# EAGLE design usb-lcd-2line-ta (EAGLE 5.11)
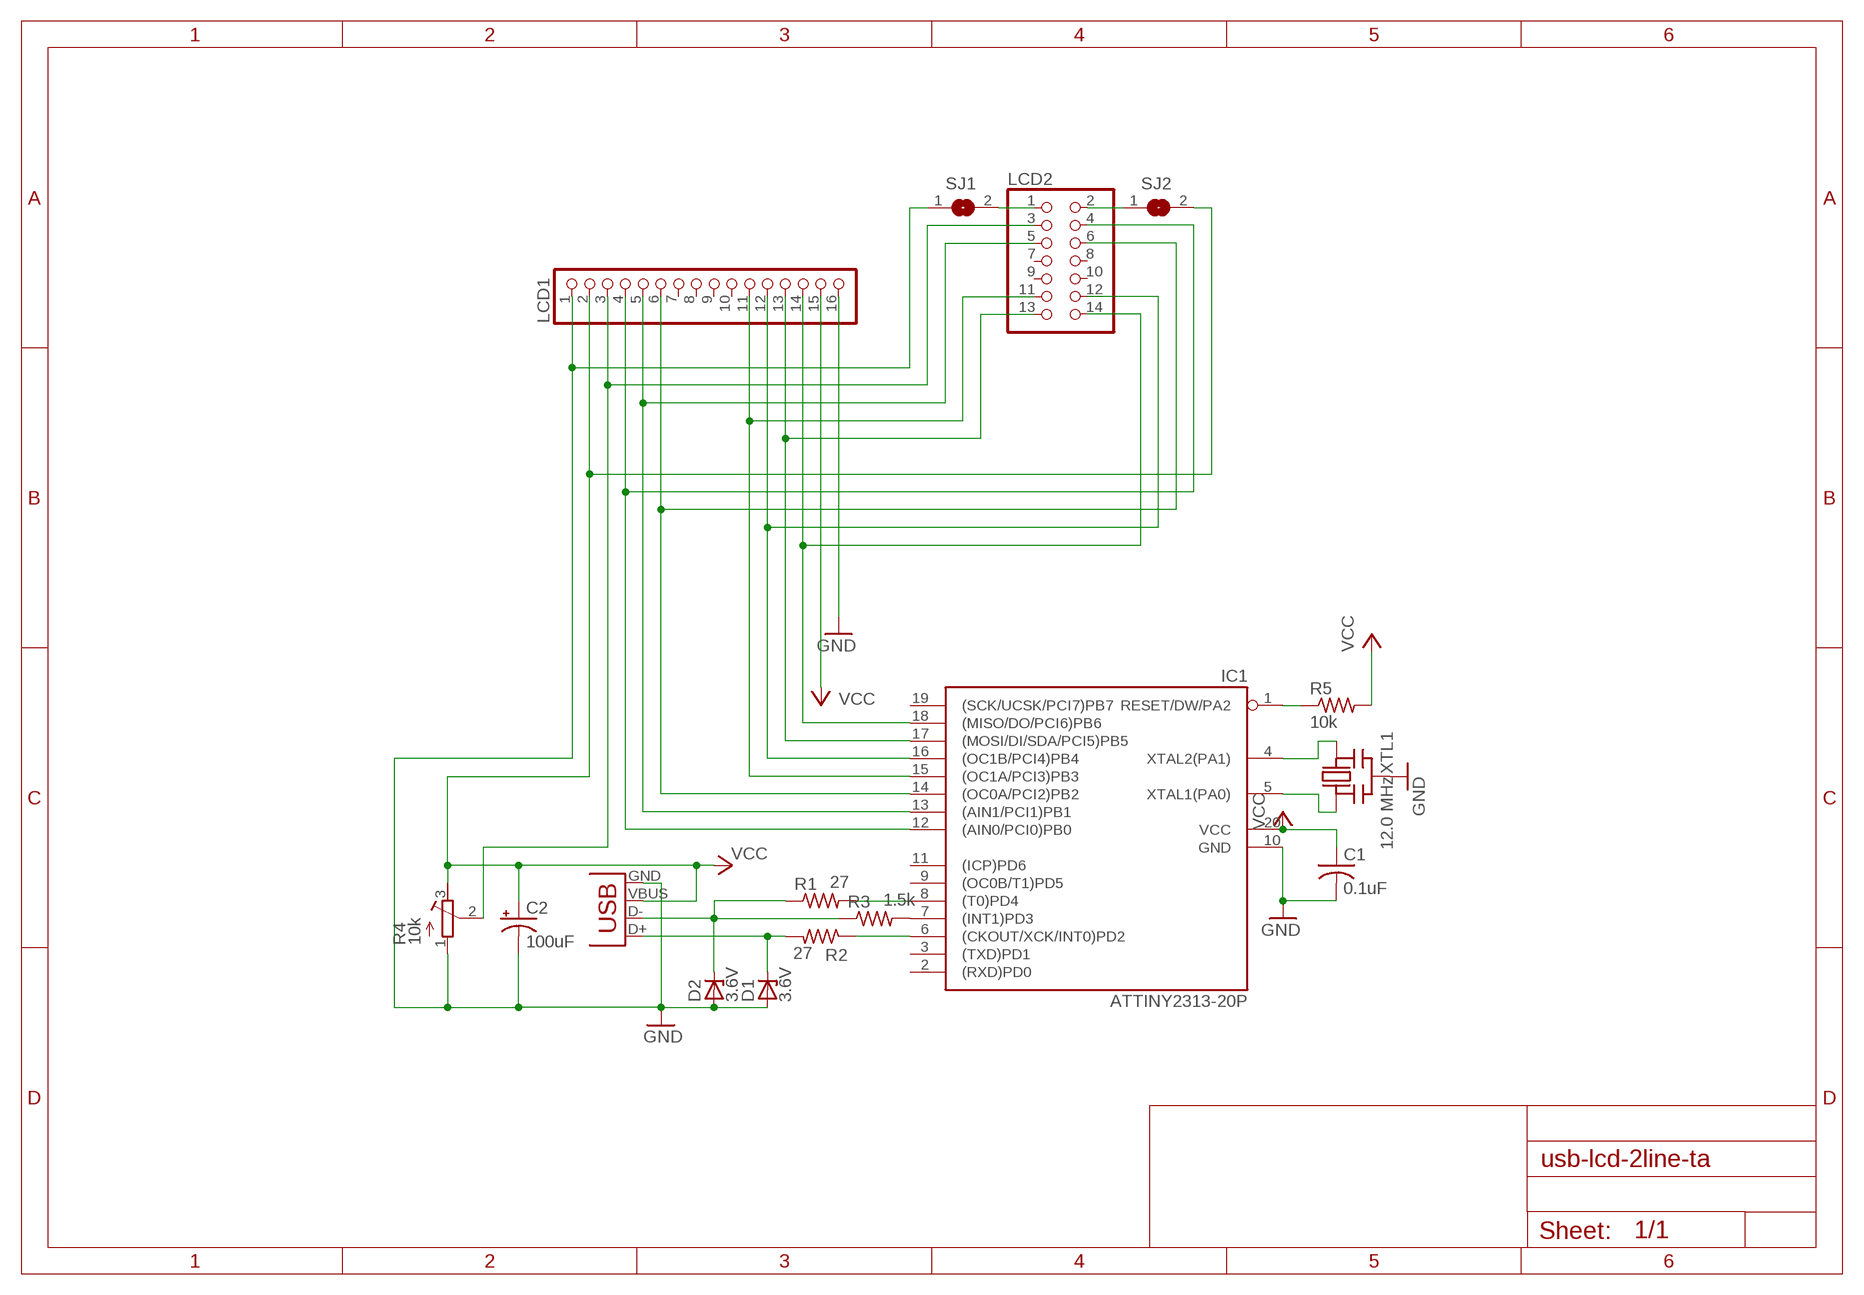
[diagram p0: schematic, sheet 1]

## Parts
C1  0.1uF  C-US025-025X050  [C025-025X050]
C2  100uF  CPOL-USE2-5  [E2-5]
D1  3.6V  ZENER-DIODEDO35Z10  [DO35Z10]
D2  3.6V  ZENER-DIODEDO35Z10  [DO35Z10]
IC1  ATTINY2313-20P  [DIL20]
LCD1  PINHD-1X16  [1X16]
LCD2  PINHD-2X7  [2X07]
R1  27  R-US_0207/10  [0207/10]
R2  27  R-US_0207/10  [0207/10]
R3  1.5k  R-US_0207/10  [0207/10]
R4  10k  R-TRIMM3296W  [RTRIM3296W]
R5  10k  R-US_0207/10  [0207/10]
SJ1  SJ  [SJ]
SJ2  SJ  [SJ]
X1  USBPTH  [USB-B-PTH]
XTL1  12.0 MHz  CERMOSCILL  [CERM_OSC]

## Nets
GND: C1.2 C2.- D1.A D2.A IC1.10(GND) LCD1.1 LCD1.16 R4.1(E) SJ1.1 X1.GND XTL1.P$2(GND)
N$1: D2.C R1.1 R3.1 X1.D-
N$2: IC1.5(XTAL1(PA0)) XTL1.P$1(IN)
N$3: IC1.8((T0)PD4) R1.2
N$4: IC1.4(XTAL2(PA1)) XTL1.P$3(OUT)
N$5: IC1.7((INT1)PD3) R3.2
N$6: IC1.6((CKOUT/XCK/INT0)PD2) R2.1
N$7: IC1.18((MISO/DO/PCI6)PB6) LCD1.14 LCD2.14
N$8: IC1.17((MOSI/DI/SDA/PCI5)PB5) LCD1.13 LCD2.13
N$9: IC1.1(RESET/DW/PA2) R5.1
N$10: D1.C R2.2 X1.D+
N$11: LCD1.3 LCD2.3 R4.2(S)
N$12: IC1.12((AIN0/PCI0)PB0) LCD1.4 LCD2.4
N$13: IC1.15((OC1A/PCI3)PB3) LCD1.11 LCD2.11
N$14: LCD2.1 SJ1.2
N$15: IC1.14((OC0A/PCI2)PB2) LCD1.6 LCD2.6
N$16: IC1.16((OC1B/PCI4)PB4) LCD1.12 LCD2.12
N$17: IC1.13((AIN1/PCI1)PB1) LCD1.5 LCD2.5
N$18: LCD2.2 SJ2.1
VCC: C1.1 C2.+ IC1.20(VCC) LCD1.2 LCD1.15 R4.3(A) R5.2 SJ2.2 X1.VBUS
Unconnected: IC1.2((RXD)PD0) IC1.3((TXD)PD1) IC1.9((OC0B/T1)PD5) IC1.11((ICP)PD6) IC1.19((SCK/UCSK/PCI7)PB7) LCD1.7 LCD1.8 LCD1.9 LCD1.10 LCD2.7 LCD2.8 LCD2.9 LCD2.10

## Library data of the parts
C1 = rcl-ez:C-US: CAPACITOR, American symbol
C2 = rcl-ez:CPOL-US: POLARIZED CAPACITOR, American symbol
D1 D2 = diode:ZENER-DIODE: Z-Diode
IC1 = avr:ATTINY2313: MICROCONTROLLER 2 Kbytes FLASH 128 bytes SRAM 128 bytes EEPROM USART USI
LCD1 = pinhead:PINHD-1X16: PIN HEADER
LCD2 = pinhead:PINHD-2X7: PIN HEADER
R1-R3 R5 = rcl-ez:R-US_: RESISTOR, American symbol
R4 = resistor:R-TRIMM: Trimm resistor
SJ1 SJ2 = jumper:SJ: SMD solder JUMPER
X1 = SparkFun:USB: USB Connectors USB-B-PTH is fully proven SKU : PRT-00139 USB-miniB is fully proven SKU : PRT-00587 USB-A-PCB is untested. USB-A-H is throughly reviewed, but untested. Spark Fun Electronics SKU : PRT-00437 USB-B-SMT is throughly reviewed, but untested. Needs silkscreen touching up. USB-A-S has not been used/tested USB-MB-H has not been used/tested
XTL1 = minimidi:CERMOSCILL

## Board
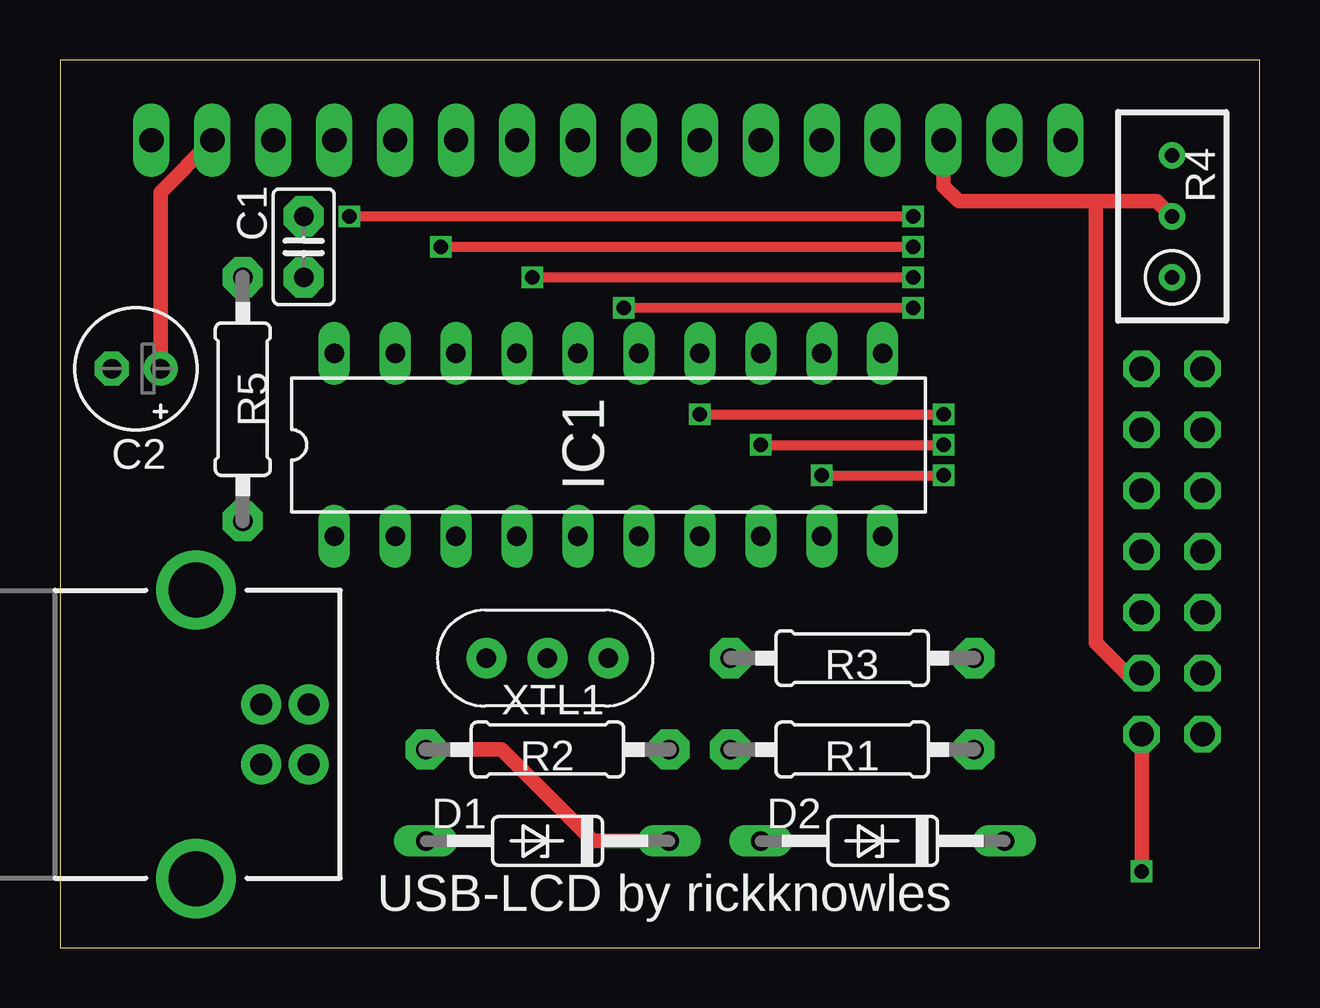
[diagram p1: board, top side]
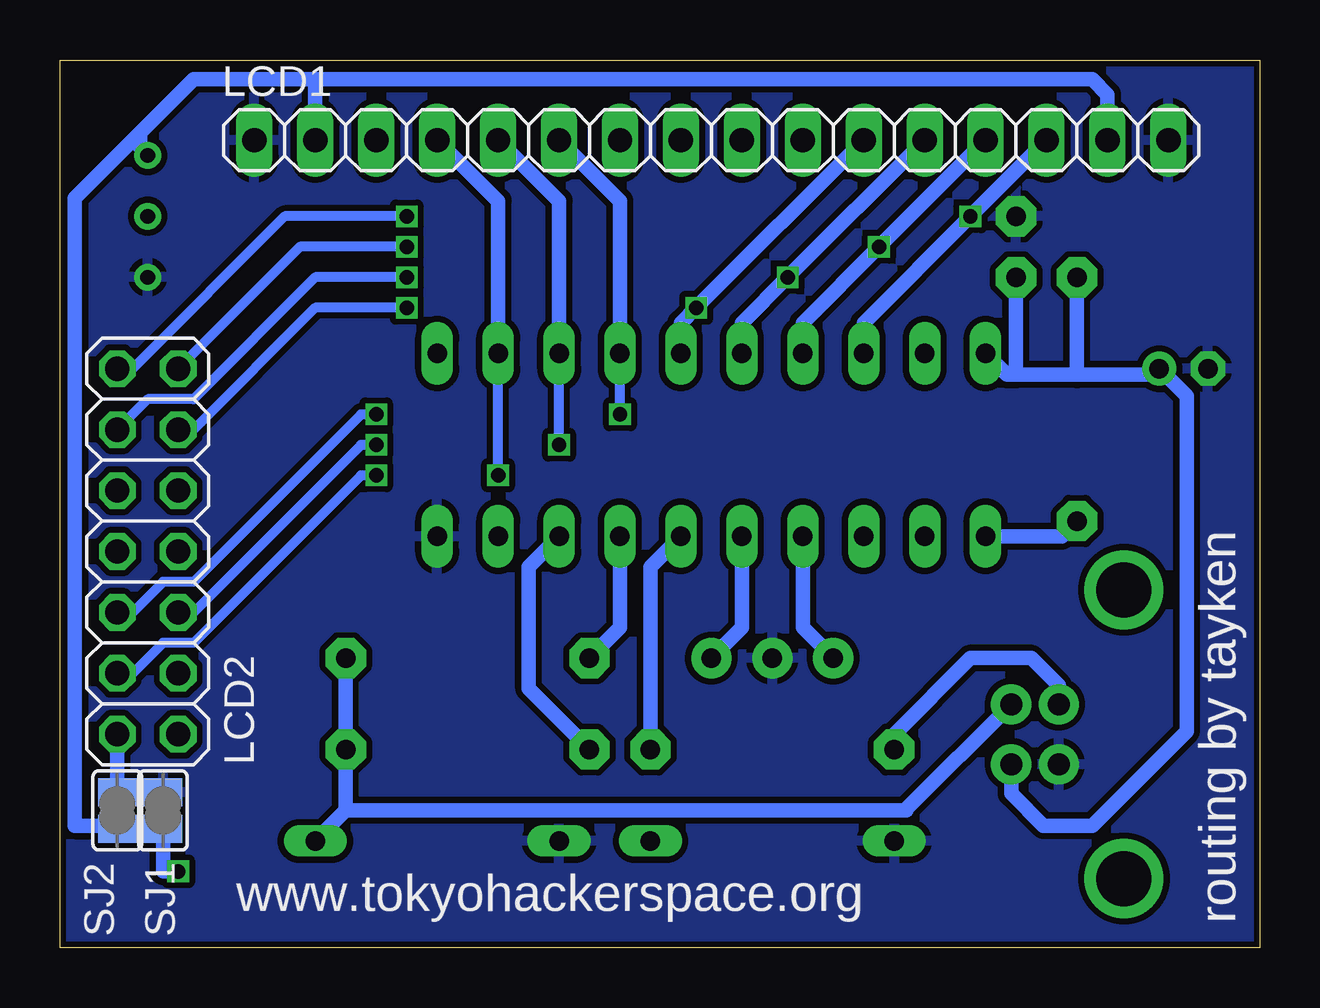
[diagram p2: board, bottom side, seen from below]

Size 50 x 37 mm. Coordinates in mm from the lower left corner, seen from the top.
Outline: 0,0 50,0 50,37 0,37 0,0
Copper layers (1*16): Top 0.035mm / dielectric 1.5mm / Bottom 0.035mm
Design rules "Fusion_eagle_rule_v1.1": minimum track width 6mil, minimum drill 12mil, track to track 6mil, track to pad 6mil, pad to pad 6mil, via to via 6mil, smd to smd 0mil, copper to edge 10mil, drill to drill 10mil, minimum pad ring 10mil, minimum via ring 6mil, stop-mask expansion 2mil, vias tented up to drill 100mil, thermal gap 10mil

### Footprints (pad centres in the part's own frame; a part is rotated, then mirrored left to right if it is on the bottom)
C025-025X050 = drill 0.813 pad 1.676 octagon: 1 -1.27,0; 2 1.27,0
E2-5 = drill 0.813 pad 1.422 round: + -1.016,0 | drill 0.813 pad 1.422 octagon: - 1.016,0
DO35Z10 = drill 0.813 long: A 5.08,0; C -5.08,0
DIL20 = drill 0.813 long: 1 -11.43,-3.81; 2 -8.89,-3.81; 3 -6.35,-3.81; 4 -3.81,-3.81; 5 -1.27,-3.81; 6 1.27,-3.81; 7 3.81,-3.81; 8 6.35,-3.81; 9 8.89,-3.81; 10 11.43,-3.81; 11 11.43,3.81; 12 8.89,3.81; 13 6.35,3.81; 14 3.81,3.81; 15 1.27,3.81; 16 -1.27,3.81; 17 -3.81,3.81; 18 -6.35,3.81; 19 -8.89,3.81; 20 -11.43,3.81
1X16 = drill 1.016 long: 1 -19.05,0; 2 -16.51,0; 3 -13.97,0; 4 -11.43,0; 5 -8.89,0; 6 -6.35,0; 7 -3.81,0; 8 -1.27,0; 9 1.27,0; 10 3.81,0; 11 6.35,0; 12 8.89,0; 13 11.43,0; 14 13.97,0; 15 16.51,0; 16 19.05,0
2X07 = drill 1.016 octagon: 1 -7.62,-1.27; 2 -7.62,1.27; 3 -5.08,-1.27; 4 -5.08,1.27; 5 -2.54,-1.27; 6 -2.54,1.27; 7 0,-1.27; 8 0,1.27; 9 2.54,-1.27; 10 2.54,1.27; 11 5.08,-1.27; 12 5.08,1.27; 13 7.62,-1.27; 14 7.62,1.27
0207/10 = drill 0.813 pad 1.676 octagon: 1 -5.08,0; 2 5.08,0
RTRIM3296W = drill 0.61 round: 1 0,-2.54; 2 0,0; 3 0,2.54
SJ = smd 1.168 x 1.6: 1 -0.762,0; 2 0.762,0
USB-B-PTH = drill 0.914 pad 1.676 round: D+ 0,1.25; D- 1.981,1.25; GND 0,-1.25; VBUS 1.981,-1.25 | drill 2.286 round: S1 -2.718,-6.02; S2 -2.718,6.02
CERM_OSC = drill 0.813 pad 1.676 round: P$1 -2.54,0; P$2 0,0; P$3 2.54,0

### Placement (x,y rotation side)
C1  10.16,29.21 90 top
C2  3.17,24.13 180 top
D1  20.32,4.45 180 top
D2  34.29,4.45 180 top
IC1  22.86,20.95 0 top
LCD1  22.86,33.66 0 bottom
LCD2  46.35,16.51 90 bottom
R1  33.02,8.26 180 top
R2  20.32,8.26 180 top
R3  33.02,12.06 180 top
R4  46.35,30.48 0 top
R5  7.62,22.86 90 top
SJ1  45.72,5.71 270 bottom
SJ2  47.62,5.71 270 bottom
X1  8.38,8.89 0 top
XTL1  20.32,12.06 180 top

### Tracks (layer width: path | path; a pad name or v marks a point on that pad's centre or on a via)
GND
  pour Bottom (isolate 0.254): 0,0 0,36.83 50.16,36.83 50.16,0
N$1
  Bottom 0.61: R3.1 R1.1 38.1,5.71 | 38.1,5.71 D2.C | 38.1,5.71 14.73,5.71 14.73,5.77 X1.D-
N$2
  Bottom 0.61: XTL1.P$1 21.59,13.34 IC1.5
N$3
  Bottom 0.61: R1.2 30.48,10.79 30.48,15.88 IC1.8
N$4
  Bottom 0.61: XTL1.P$3 19.05,13.34 IC1.4
N$5
  Bottom 0.61: R3.2 26.67,13.34 IC1.7
N$6
  Bottom 0.61: R2.1 25.4,15.88 IC1.6
N$7  (via drill 0.6)
  Top 0.406: v12.06,30.48 v35.56,30.48
  Bottom 0.406: LCD2.14 46.99,24.13 40.64,30.48 v35.56,30.48
  Bottom 0.61: IC1.18 16.51,26.04 v12.06,30.48 LCD1.14
N$8  (via drill 0.6)
  Top 0.406: v15.88,29.21 v35.56,29.21
  Bottom 0.406: v35.56,29.21 40.01,29.21 LCD2.13
  Bottom 0.61: IC1.17 19.05,26.04 v15.88,29.21 LCD1.13
N$9
  Bottom 0.61: R5.1 8.26,17.14 IC1.1
N$10
  Top 0.61: R2.2 18.41,8.26 22.23,4.45 D1.C
  Bottom 0.61: X1.D+ 8.38,10.92 9.53,12.06 12.06,12.06 15.24,8.89 R2.2
N$11
  Top 0.61: LCD1.3 36.83,31.75 37.47,31.11 43.18,31.11 | 43.18,31.11 45.72,31.11 R4.2 | 43.18,31.11 43.18,12.7 44.45,11.43 LCD2.3
N$12  (via drill 0.6)
  Top 0.406: v31.75,19.68 v36.83,19.68
  Bottom 0.406: v31.75,19.68 IC1.12 | v36.83,19.68 37.47,19.68 44.45,12.7 45.72,12.7 46.99,11.43 LCD2.4
  Bottom 0.61: IC1.12 31.75,31.11 LCD1.4
N$13  (via drill 0.6)
  Top 0.406: v23.5,26.67 v35.56,26.67
  Bottom 0.406: LCD2.11 44.45,21.59 39.37,26.67 v35.56,26.67
  Bottom 0.61: IC1.15 24.13,26.04 v23.5,26.67 LCD1.11
N$14  (via drill 0.6)
  Top 0.61: v45.09,3.17 LCD2.1
  Bottom 0.61: v45.09,3.17 45.72,3.17 SJ1.2
N$15  (via drill 0.6)
  Top 0.406: v26.67,22.23 v36.83,22.23
  Bottom 0.406: v26.67,22.23 IC1.14 | v36.83,22.23 37.47,22.23 44.45,15.24 45.72,15.24 46.99,13.97 LCD2.6
  Bottom 0.61: IC1.14 26.67,31.11 LCD1.6
N$16  (via drill 0.6)
  Top 0.406: v19.68,27.94 v35.56,27.94
  Bottom 0.406: LCD2.12 46.35,22.86 44.45,22.86 39.37,27.94 v35.56,27.94
  Bottom 0.61: IC1.16 21.59,26.04 v19.68,27.94 LCD1.12
N$17  (via drill 0.6)
  Top 0.406: v29.21,20.95 v36.83,20.95
  Bottom 0.406: v29.21,20.95 IC1.13 | v36.83,20.95 37.47,20.95 44.45,13.97 LCD2.5
  Bottom 0.61: IC1.13 29.21,31.11 LCD1.5
N$18
  Bottom 0.61: SJ2.1 LCD2.2
VCC
  Top 0.61: C2.+ 4.19,31.5 LCD1.15
  Bottom 0.61: X1.VBUS 10.36,6.43 9.02,5.08 6.99,5.08 3.05,9.02 3.05,22.99 C2.+ 3.81,23.88 7.62,23.88 | LCD1.15 6.35,35.56 6.99,36.2 39.37,36.2 | 39.37,36.2 44.45,36.2 46.67,33.97 | 39.37,36.2 LCD1.2 | SJ2.2 47.75,5.08 49.4,5.08 49.4,31.24 46.67,33.97 | 7.62,23.88 10.16,23.88 | 10.16,23.88 10.54,23.88 IC1.20 | 10.16,23.88 C1.1 | 7.62,23.88 R5.2 | R4.3 46.67,33.34 46.67,33.97

### Text on the board
tPlace: USB-LCD by rickknowles
bPlace: www.tokyohackerspace.org | routing by tayken